# Altium schematic sheet power.SchDoc
size A4
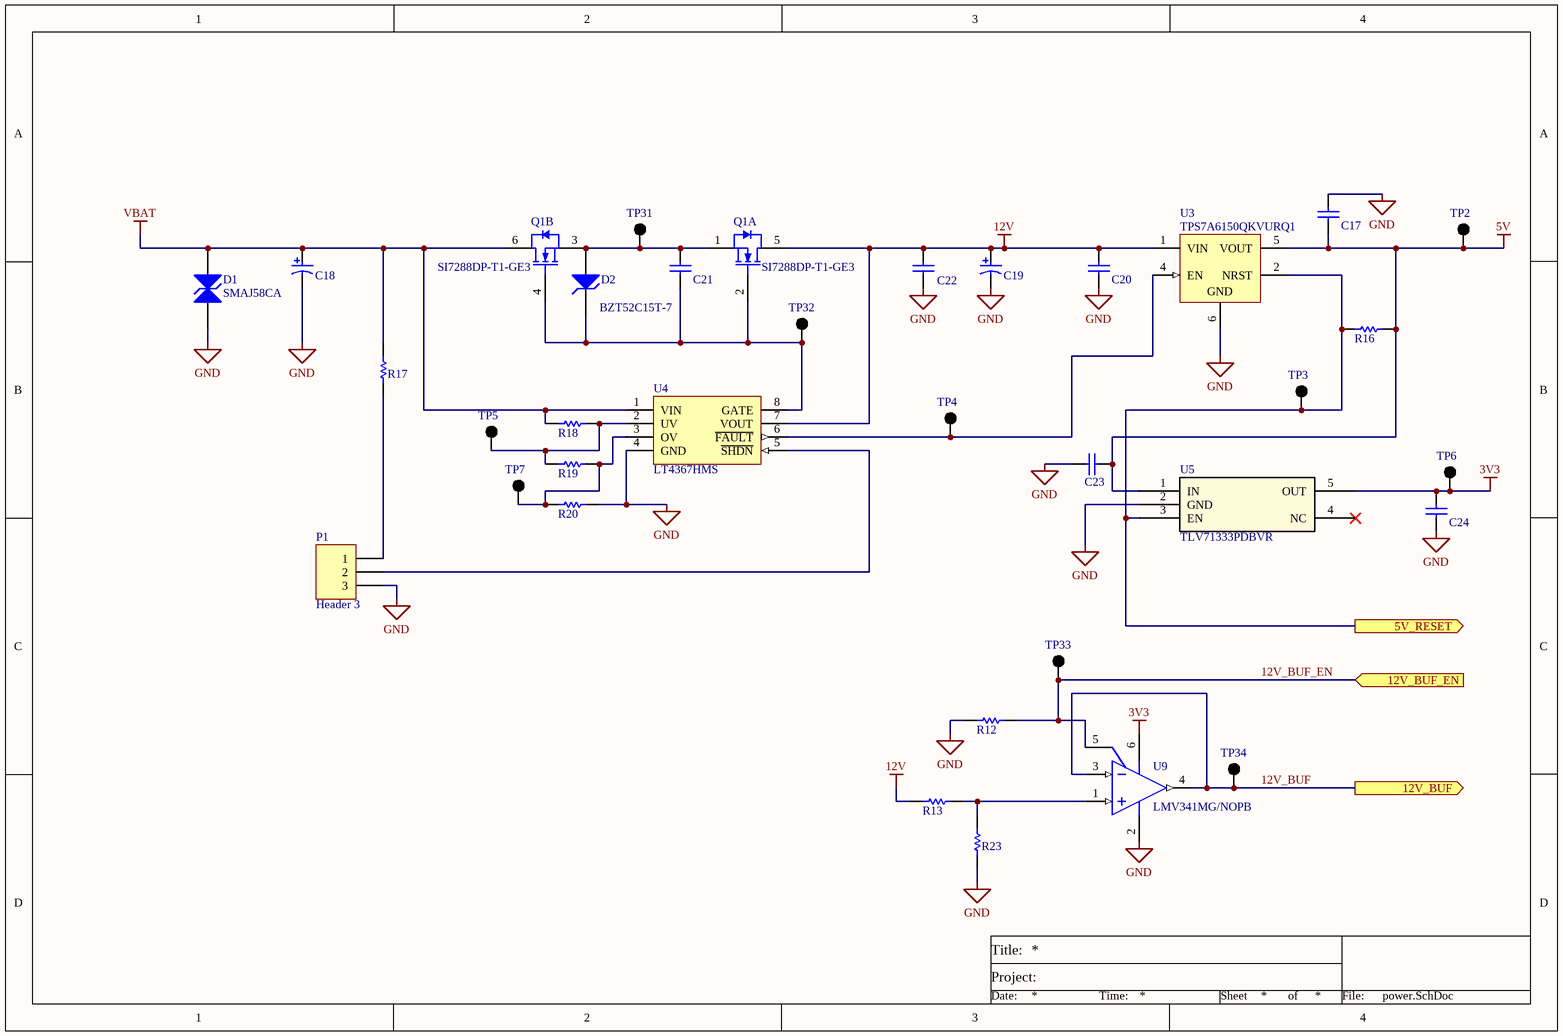
[diagram p0: power.SchDoc]

## Parts
C17  Generic 0805 Capacitor  [0805]  (value not drawn)
C18  Generic Electrolytic Capacitor  [NIC-UUX2A470MNL1GS_M]  (value not drawn)
C19  Generic Electrolytic Capacitor  [NIC-UUX2A470MNL1GS_M]  (value not drawn)
C20  Generic 0805 Capacitor  [0805]  (value not drawn)
C21  Generic 0805 Capacitor  [0805]  (value not drawn)
C22  Generic 0805 Capacitor  [0805]  (value not drawn)
C23  Generic 0805 Capacitor  [0805]  (value not drawn)
C24  Generic 0805 Capacitor  [0805]  (value not drawn)
D1  SMAJ58CA  [VISH-DO-214AC-2_M]
D2  BZT52C15T-7  [DIOD-SOD123-2_V]
P1  Header 3  [HDR1X3]
Q1  SI7288DP-T1-GE3  [VISH-POWERPAKSO-8_A_V]  (parts A,B of 2)
R12  Generic 0603 Resistor  [0603]  (value not drawn)
R13  Generic 0603 Resistor  [0603]  (value not drawn)
R16  Generic 0603 Resistor  [0603]  (value not drawn)
R17  Generic 0603 Resistor  [0603]  (value not drawn)
R18  Generic 0603 Resistor  [0603]  (value not drawn)
R19  Generic 0603 Resistor  [0603]  (value not drawn)
R20  Generic 0603 Resistor  [0603]  (value not drawn)
R23  Generic 0603 Resistor  [0603]  (value not drawn)
TP2  5001  [KSTN-5001]  (value not drawn)
TP3  5001  [KSTN-5001]  (value not drawn)
TP4  5001  [KSTN-5001]  (value not drawn)
TP5  5001  [KSTN-5001]  (value not drawn)
TP6  5001  [KSTN-5001]  (value not drawn)
TP7  5001  [KSTN-5001]  (value not drawn)
TP31  5001  [KSTN-5001]  (value not drawn)
TP32  5001  [KSTN-5001]  (value not drawn)
TP33  5001  [KSTN-5001]  (value not drawn)
TP34  5001  [KSTN-5001]  (value not drawn)
U3  TPS7A6150QKVURQ1  [KVU0005A_M]
U4  LT4367HMS  [MSOP8_M]
U5  TLV71333PDBVR  [DBV5-M]
U9  LMV341MG/NOPB  [DCK0006A_M]

## Ports
5V_RESET (out), 12V_BUF (out), 12V_BUF_EN (in)

## Nets
3V3: C24.2 TP6.1 U5.5(OUT) U9.6(V+)
5V: C17.1 C23.2 R16.2 TP2.1 U3.5(VOUT) U5.1(IN)
12V: C19.1 C20.2 C22.2 Q1.5(G2) R13.1 U3.1(VIN) U4.7(VOUT)
GND: C17.2 C18.2 C19.2 C20.1 C22.1 C23.1 C24.1 D1.1(A1) P1.3 R12.2 R20.2 R23.1 U3.6(GND) U4.4(GND) U5.2(GND) U9.2(GND)
VBAT: C18.1 D1.2(A2) Q1.6(G2) R17.2 R18.1 U4.1(VIN)
5V_RESET: R16.1 TP3.1 U3.2(NRST) U5.3(EN) ; port 5V_RESET
12V_BUF: TP34.1 U9.3(IN-) U9.4(OUT) ; port 12V_BUF
12V_BUF_EN: R12.1 TP33.1 U9.5(~{SHDN}) ; port 12V_BUF_EN
NetC21_1: C21.1 D2.2(K) Q1.2(G2) Q1.4(G2) TP32.1 U4.8(GATE)
NetC21_2: C21.2 D2.1(A) Q1.1(S2) Q1.3(S2) TP31.1
NetP1_1: P1.1 R17.1
NetP1_2: P1.2 U4.5(~{SHDN})
NetR13_2: R13.2 R23.2 U9.1(IN+)
NetR18_2: R18.2 R19.1 TP5.1 U4.2(UV)
NetR19_2: R19.2 R20.1 TP7.1 U4.3(OV)
NetTP4_1: TP4.1 U3.4(EN) U4.6(~{FAULT})

Not connected (* = marked no-connect by the designer): U5 4(NC)*

## Notes on the sheet
- Title
- Title:
- Project:
- Size:
- Date:
- File:
- E
- Number:
- Time:
- Revision:
- Sheet
- of

## Library data of the parts
C17 C20-C24 = C_0805: Value: *; Specifications: *
C18 C19 = C_can: Generic PCAP_10x10 Can Aluminum Electrolytic Capacitor
D1 = SMAJ58CA: Transient Voltage Suppressor, 6.40 to 231 V, 58 V Stand-off Voltage, Bi-Directional, -55 to 155 degC, 2-pin DO-214AC, Pb-Free, Tape and Reel; Manufacturer: Vishay Semiconductor; PartNumber: SMAJ58CA-E3/5A; VWM (V): 58; IFSM: 40 A; VBR Bi-Directional (V): 6.4 to 231; ID (uA): 2; PPPM (W): 400, 300; ComponentLink2Description: Datasheet; ComponentLink1URL: http://www.vishay.com/; ComponentLink2URL: http://www.vishay.com/docs/88390/smaj50a.pdf; PackageReference: DO-214AC-2; Operating Junction and Storage Temperature Range: -55 to 150 degC; DatasheetVersion: 12/8/2013; ComponentLink3Description: Package Specification; RoHS: TRUE; Mounting Technology: Surface Mount; ComponentLink1Description: Manufacturer URL; PackageDescription: 2-Pin DO-214AC (SMA), Body 4.245 x 2.665 mm; ComponentLink3URL: http://www.vishay.com/docs/88390/smaj50a.pdf; Packing: Tape and Reel; Supplier 1: Digi-Key; Supplier Part Number 1: SMAJ58CALFCT-ND
D2 = BZT52C15T: Zener Diode 15V 300mW ±6% Surface Mount SOD-523; Manufacturer: Diodes Inc; PartNumber: BZT52C16-7-F; Maximum Reverse Current: 0.1 uA; Tol V: 5.56% Typ.; Maximum Zener Impedance f: 1 kHz ZZK=200 Ohm; Voltage Zener: 16 V Typ.; Packing: Tape and Reel; Power Max: 500 mW; ComponentLink2URL: http://www.diodes.com/datasheets/ds18004.pdf; PackageDescription: 2-Pin SOD123, Body 2.7 x 1.55 mm, Height 1.45 mm; ComponentLink3Description: Package Specification; Mounting Technology: Surface Mount; PackageReference: SOD123; ComponentLink2Description: Datasheet; RoHS: TRUE; ComponentLink3URL: http://www.diodes.com/datasheets/ap02002.pdf; Operating Temperature: -65 to 150 degC; DatasheetVersion: Rev. 37-2; ComponentLink1Description: Manufacturer URL; ComponentLink1URL: http://www.diodes.com/; PackageVersion: Rev. 79
P1 = Header 3: Header, 3-Pin; LatestRevisionDate: 17-Jul-2002; LatestRevisionNote: Re-released for DXP Platform.; Publisher: Altium Limited
Q1 = SI7288DP: Dual N-Channel (D-S) MOSFET, 40 V, 20 A, -55 to 150 degC, 8-Pin POWERPAKSO-8, RoHS, Tape and Reel; Manufacturer: Vishay; Gate Charge (Qg) @ Vgs: 15nC@10V; FET Feature: Standard; Rds On (Max) @ Id, Vgs: 19mOhm@10A,10V; Drain to Source Voltage (Vdss): 40V; Other Names: SI7288DP-T1-GE3DKR; Online Catalog: N-ChannelStandardFETs; Power - Max: 15.6W; PCN Assembly/Origin: MultipleFabracationChanges09/Jul/2014; Input Capacitance (Ciss) @ Vds: 565pF@20V; Current - Continuous Drain (Id) @ 25°C: 20A; Vgs(th) (Max) @ Id: 2.8V@250µA; FET Type: 2N-Channel(Dual); Package Reference: POWERPAKSO-8; Datasheet URL: http://www.vishay.com/docs/65366/si7288dp.pdf; Package Description: 8-Pin Surface Mount Device, Body 6.15 x 5.155 mm, Pitch 1.27 mm; Manufacturer URL: http://www.vishay.com/; Package / Case: PowerPAK®SO-8Dual; Category: DiscreteSemiconductorProducts; Mounting Type: SurfaceMount; Standard Package: 1; Mounting Technology: SurfaceMount; Series: TrenchFET®; Datasheet Version: Rev. A, 10/2009; Supplier Device Package: PowerPAK®SO-8Dual; Family: FETs-Arrays; Packaging: Digi-Reel®
R12 R13 R16-R20 R23 = R_0603: Value: *; Specifications: *
TP2-TP7 TP31-TP34 = TP5001: Test Point, Black, 1-Pin THD, RoHS, Bulk; Manufacturer: Keystone; Other Names: 5001K; Catalog Drawings: 5000Series; Alternate Color: 5004K-ND / -TESTPOINTPCMINI.040"DYELLOW / 5003K-ND / -TESTPOINTPCMINI.040"DORANGE / 5002K-ND / -TESTPOINTPCMINI.040"DWHITE / 5000K-ND / -TESTPOINTPCMINI.040"DRED; Kits: DKTGRS232C-KIT-ND / -TTLCONVERTER; Online Catalog: ColorCodedTestPoints; Datasheet URL: https://ciiva.com/datasheet-click-2917627?src=ciiva&sig=bd195616; Mounting Type: 0.040"(1.02mm)HoleDiameter; Family: TestPoints; RoHS Information: RoHSComplianceStatement; Datasheet Version: Rev. G, 12/2008; Color: Black; Category: TestandMeasurement; Standard Package: 100; Manufacturer URL: http://www.keyelco.com/; Material: Base,Nylon46,UL94V-0; Type: PCTestPoint,Miniature; Terminal: 0.010"x0.020"(0.25mmx0.51mm)PhosphorBronzeWire,SilverPlated; Series: THM; Packaging: Bulk
U3 = TPS7A6150-Q1: Single Output Automotive LDO, 300 mA, Fixed 5 V Output, 4 to 40 V Input, with Ultra-Low IQ, 5-pin PFM (KVU), -40 to 125 degC, Green (RoHS & no Sb/Br); Manufacturer: Texas Instruments; Vin(Min)(V): 4; Fixed Output Options(V): 5; Vdo(Typ)(mV): 300; Accuracy(%): 2; Iq(Typ)(mA): 0.02; Iout(Max)(A): 0.3; SubFamily: Single Channel LDO; Vin(Max)(V): 40; PackageReference: KVU0005A; ComponentLink2URL: http://www.ti.com/general/docs/lit/getliterature.tsp?genericPartNumber=TPS7A6150-Q1&fileType=pdf; PackageDescription: 5-Pin Plastic Flange Mount, Body 6.1 x 6.6 mm, Pitch 1.14 mm; Vout Adj(Max)(V): 5; ComponentLink1Description: Manufacturer URL; ComponentLink1URL: http://www.ti.com/; DatasheetVersion: SLVSA62G; PartNumber: TPS7A6150QKVURQ1; ComponentLink2Description: Datasheet; Mounting Technology: Surface Mount; PackageVersion: 4205521-3/D; Vout Adj(Min)(V): 5; ComponentLink3Description: Package Specification; Eco-Plan: Green (RoHS & no Sb/Br); Code_JEDEC: TO-252; ComponentLink3URL: http://www.ti.com/lit/ml/mpsf019/mpsf019.pdf; Supplier 1: Digi-Key; Supplier Part Number 1: 296-36856-6-ND
U4 = LT4367: 100V Overvoltage, Undervoltage and Reverse Supply Protection Controller; ComponentLink1Description: Manufacturer URL; ComponentLink3Description: Package Specification; ComponentLink2URL: http://cds.linear.com/docs/en/datasheet/4356fa.pdf; ComponentLink3URL: http://cds.linear.com/docs/en/packaging/05081661_F_MS.pdf; ComponentLink1URL: http://www.linear.com/; ComponentLink2Description: Datasheet
U5 = TLV71333PDBVR: REG LINEAR 3.3V 150MA SOT23-5; Manufacturer_Part_Number: TLV71333PDBVR; Supplier 1: Digi-Key; Supplier Part Number 1: 296-35591-6-ND
U9 = LMV341: Single with Shutdown/Dual/Quad General Purpose, 2.7V, Rail-to-Rail Output, 125°C, Operational Amplifiers, 6-pin SC-70, Pb-Free; Manufacturer: Texas Instruments; PowerWise: N; PackageTopMarking: A78*XTT; RoHS: Y; Package Reference: DCK0006A; CompType: Amplifiers; ComponentLink1URL: http://www.ti.com/general/docs/lit/getliterature.tsp?genericPartNumber=LMV341-N&fileType=pdf; PinCount: 6; ComponentLink1Description: Datasheet URL; PackageDescription: Molded SC-70, 2 x 1.25 x .9mm, 6 Lead, 0.65mm Pitch